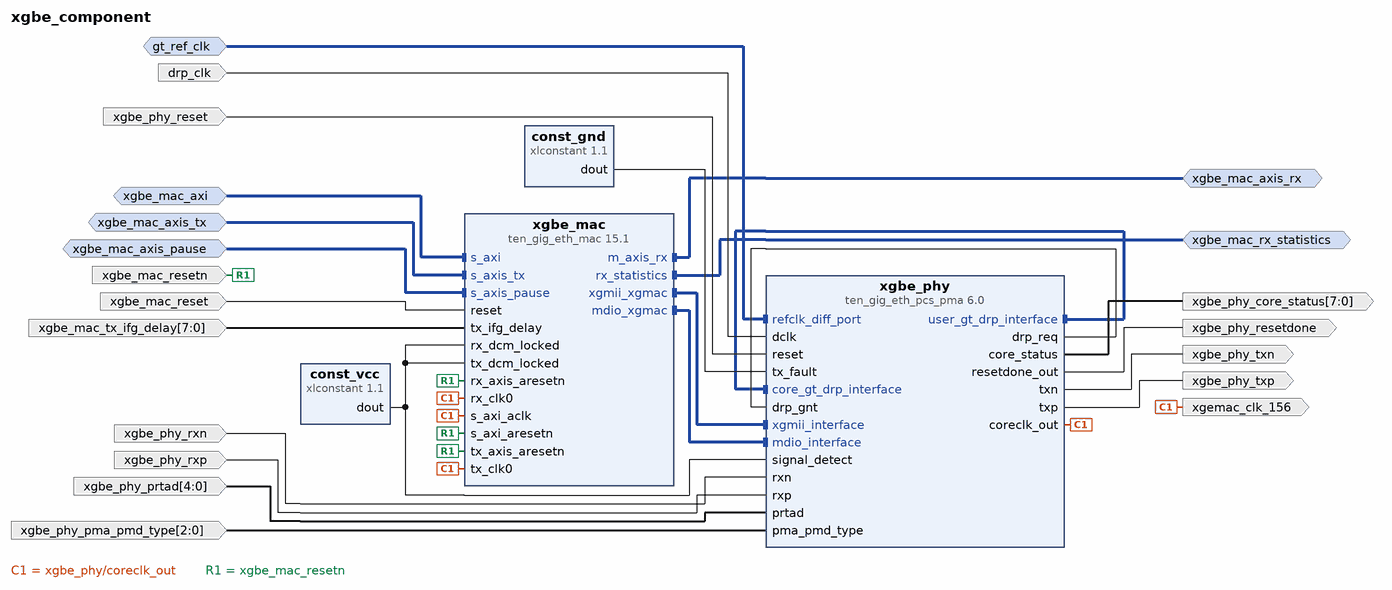
[diagram p0: block diagram of the top level]
# Vivado block design xgbe_component, xc7z045ffg900-2, Vivado 2017.4
create_bd_design xgbe_component

create_bd_intf_port -mode Slave -vlnv xilinx.com:interface:aximm_rtl:1.0 xgbe_mac_axi
set_property -dict [list \
  CONFIG.DATA_WIDTH 32 \
  CONFIG.PROTOCOL AXI4LITE \
  CONFIG.FREQ_HZ 156250000 \
  CONFIG.ID_WIDTH 0 \
  CONFIG.ADDR_WIDTH 32 \
  CONFIG.AWUSER_WIDTH 0 \
  CONFIG.ARUSER_WIDTH 0 \
  CONFIG.WUSER_WIDTH 0 \
  CONFIG.RUSER_WIDTH 0 \
  CONFIG.BUSER_WIDTH 0 \
  CONFIG.READ_WRITE_MODE READ_WRITE \
  CONFIG.HAS_BURST 1 \
  CONFIG.HAS_LOCK 1 \
  CONFIG.HAS_PROT 1 \
  CONFIG.HAS_CACHE 1 \
  CONFIG.HAS_QOS 1 \
  CONFIG.HAS_REGION 1 \
  CONFIG.HAS_WSTRB 1 \
  CONFIG.HAS_BRESP 1 \
  CONFIG.HAS_RRESP 1 \
  CONFIG.SUPPORTS_NARROW_BURST 0 \
  CONFIG.NUM_READ_OUTSTANDING 1 \
  CONFIG.NUM_WRITE_OUTSTANDING 1 \
  CONFIG.MAX_BURST_LENGTH 1 \
  CONFIG.NUM_READ_THREADS 1 \
  CONFIG.NUM_WRITE_THREADS 1 \
  CONFIG.RUSER_BITS_PER_BYTE 0 \
  CONFIG.WUSER_BITS_PER_BYTE 0 \
] [get_bd_intf_ports xgbe_mac_axi]
create_bd_intf_port -mode Slave -vlnv xilinx.com:interface:axis_rtl:1.0 xgbe_mac_axis_tx
set_property -dict [list \
  CONFIG.TDATA_NUM_BYTES 8 \
  CONFIG.TDEST_WIDTH 0 \
  CONFIG.TID_WIDTH 0 \
  CONFIG.TUSER_WIDTH 0 \
  CONFIG.HAS_TREADY 1 \
  CONFIG.HAS_TSTRB 0 \
  CONFIG.HAS_TKEEP 1 \
  CONFIG.HAS_TLAST 1 \
  CONFIG.FREQ_HZ 156250000 \
  CONFIG.LAYERED_METADATA undef \
] [get_bd_intf_ports xgbe_mac_axis_tx]
create_bd_intf_port -mode Master -vlnv xilinx.com:interface:axis_rtl:1.0 xgbe_mac_axis_rx
set_property -dict {CONFIG.FREQ_HZ 156250000} [get_bd_intf_ports xgbe_mac_axis_rx]
create_bd_intf_port -mode Slave -vlnv xilinx.com:interface:axis_rtl:1.0 xgbe_mac_axis_pause
set_property -dict [list \
  CONFIG.TDATA_NUM_BYTES 2 \
  CONFIG.TDEST_WIDTH 0 \
  CONFIG.TID_WIDTH 0 \
  CONFIG.TUSER_WIDTH 0 \
  CONFIG.HAS_TREADY 0 \
  CONFIG.HAS_TSTRB 0 \
  CONFIG.HAS_TKEEP 0 \
  CONFIG.HAS_TLAST 0 \
  CONFIG.FREQ_HZ 156250000 \
  CONFIG.LAYERED_METADATA undef \
] [get_bd_intf_ports xgbe_mac_axis_pause]
create_bd_intf_port -mode Master -vlnv xilinx.com:display_ten_gig_eth_mac:statistics_rtl:2.0 xgbe_mac_rx_statistics
create_bd_intf_port -mode Slave -vlnv xilinx.com:interface:diff_clock_rtl:1.0 gt_ref_clk
set_property -dict {CONFIG.FREQ_HZ 156250000} [get_bd_intf_ports gt_ref_clk]
create_bd_port -dir O -type clk xgemac_clk_156
set_property -dict [list \
  CONFIG.FREQ_HZ 156250000 \
  CONFIG.ASSOCIATED_BUSIF xgbe_mac_axis_tx:xgbe_mac_axis_rx:xgbe_mac_axis_pause:xgbe_mac_axi \
  CONFIG.ASSOCIATED_RESET xgbe_mac_reset:xgbe_mac_resetn \
] [get_bd_ports xgemac_clk_156]
create_bd_port -dir I -type rst xgbe_phy_reset
set_property -dict {CONFIG.POLARITY ACTIVE_HIGH} [get_bd_ports xgbe_phy_reset]
create_bd_port -dir O -type rst xgbe_phy_resetdone
create_bd_port -dir I -type rst xgbe_mac_reset
set_property -dict {CONFIG.POLARITY ACTIVE_HIGH} [get_bd_ports xgbe_mac_reset]
create_bd_port -dir I -type rst xgbe_mac_resetn
create_bd_port -dir I xgbe_phy_rxn
create_bd_port -dir I xgbe_phy_rxp
create_bd_port -dir O xgbe_phy_txn
create_bd_port -dir O xgbe_phy_txp
create_bd_port -dir I -from 4 -to 0 xgbe_phy_prtad
create_bd_port -dir I -from 2 -to 0 xgbe_phy_pma_pmd_type
create_bd_port -dir O -from 7 -to 0 xgbe_phy_core_status
create_bd_port -dir I -from 7 -to 0 xgbe_mac_tx_ifg_delay
create_bd_port -dir I -type clk drp_clk

create_bd_cell -type ip -vlnv xilinx.com:ip:ten_gig_eth_mac:15.1 xgbe_mac
set_property -dict {CONFIG.Management_Frequency 156.25} [get_bd_cells xgbe_mac]
create_bd_cell -type ip -vlnv xilinx.com:ip:ten_gig_eth_pcs_pma:6.0 xgbe_phy
set_property -dict {CONFIG.SupportLevel 1 CONFIG.DClkRate 50.00} [get_bd_cells xgbe_phy]
create_bd_cell -type ip -vlnv xilinx.com:ip:xlconstant:1.1 const_vcc
create_bd_cell -type ip -vlnv xilinx.com:ip:xlconstant:1.1 const_gnd
set_property -dict {CONFIG.CONST_VAL 0} [get_bd_cells const_gnd]

# ---- connections ----

connect_bd_intf_net -intf_net deoi_xgbe_xgmii [get_bd_intf_pins xgbe_mac/xgmii_xgmac] [get_bd_intf_pins xgbe_phy/xgmii_interface]
connect_bd_intf_net -intf_net deoi_xgbe_mdio [get_bd_intf_pins xgbe_mac/mdio_xgmac] [get_bd_intf_pins xgbe_phy/mdio_interface]
connect_bd_intf_net -intf_net xgbe_phy_gt_drp [get_bd_intf_pins xgbe_phy/user_gt_drp_interface] [get_bd_intf_pins xgbe_phy/core_gt_drp_interface]
connect_bd_intf_net [get_bd_intf_ports xgbe_mac_axi] [get_bd_intf_pins xgbe_mac/s_axi]
connect_bd_intf_net [get_bd_intf_ports xgbe_mac_axis_tx] [get_bd_intf_pins xgbe_mac/s_axis_tx]
connect_bd_intf_net [get_bd_intf_ports xgbe_mac_axis_rx] [get_bd_intf_pins xgbe_mac/m_axis_rx]
connect_bd_intf_net -intf_net xgbe_mac_pause [get_bd_intf_ports xgbe_mac_axis_pause] [get_bd_intf_pins xgbe_mac/s_axis_pause]
connect_bd_intf_net -intf_net xgbe_mac_rx_static [get_bd_intf_ports xgbe_mac_rx_statistics] [get_bd_intf_pins xgbe_mac/rx_statistics]
connect_bd_intf_net [get_bd_intf_ports gt_ref_clk] [get_bd_intf_pins xgbe_phy/refclk_diff_port]
connect_bd_net -net xgemac_clk_156 [get_bd_pins xgbe_phy/coreclk_out] \
  [get_bd_ports xgemac_clk_156] [get_bd_pins xgbe_mac/tx_clk0] [get_bd_pins xgbe_mac/rx_clk0] \
  [get_bd_pins xgbe_mac/s_axi_aclk]
connect_bd_net [get_bd_ports drp_clk] [get_bd_pins xgbe_phy/dclk]
connect_bd_net -net xgbe_phy_resetdone [get_bd_pins xgbe_phy/resetdone_out] [get_bd_ports xgbe_phy_resetdone]
connect_bd_net [get_bd_ports xgbe_phy_reset] [get_bd_pins xgbe_phy/reset]
connect_bd_net [get_bd_ports xgbe_mac_reset] [get_bd_pins xgbe_mac/reset]
connect_bd_net [get_bd_ports xgbe_mac_resetn] \
  [get_bd_pins xgbe_mac/rx_axis_aresetn] [get_bd_pins xgbe_mac/s_axi_aresetn] [get_bd_pins xgbe_mac/tx_axis_aresetn]
connect_bd_net [get_bd_ports xgbe_phy_rxn] [get_bd_pins xgbe_phy/rxn]
connect_bd_net [get_bd_ports xgbe_phy_rxp] [get_bd_pins xgbe_phy/rxp]
connect_bd_net [get_bd_pins xgbe_phy/txn] [get_bd_ports xgbe_phy_txn]
connect_bd_net [get_bd_pins xgbe_phy/txp] [get_bd_ports xgbe_phy_txp]
connect_bd_net -net xgbe_phy_drp [get_bd_pins xgbe_phy/drp_req] [get_bd_pins xgbe_phy/drp_gnt]
connect_bd_net -net const_gnd [get_bd_pins const_gnd/dout] [get_bd_pins xgbe_phy/tx_fault]
connect_bd_net -net const_vcc [get_bd_pins const_vcc/dout] \
  [get_bd_pins xgbe_phy/signal_detect] [get_bd_pins xgbe_mac/rx_dcm_locked] [get_bd_pins xgbe_mac/tx_dcm_locked]
connect_bd_net [get_bd_ports xgbe_phy_prtad] [get_bd_pins xgbe_phy/prtad]
connect_bd_net [get_bd_ports xgbe_phy_pma_pmd_type] [get_bd_pins xgbe_phy/pma_pmd_type]
connect_bd_net [get_bd_pins xgbe_phy/core_status] [get_bd_ports xgbe_phy_core_status]
connect_bd_net [get_bd_ports xgbe_mac_tx_ifg_delay] [get_bd_pins xgbe_mac/tx_ifg_delay]

validate_bd_design
save_bd_design
